# Altium schematic sheet ATSAM3X8E Main Controller - TR R1.1.SchDoc
size Tabloid; DocumentNumber: 1; SheetNumber: 1; SheetTotal: 8
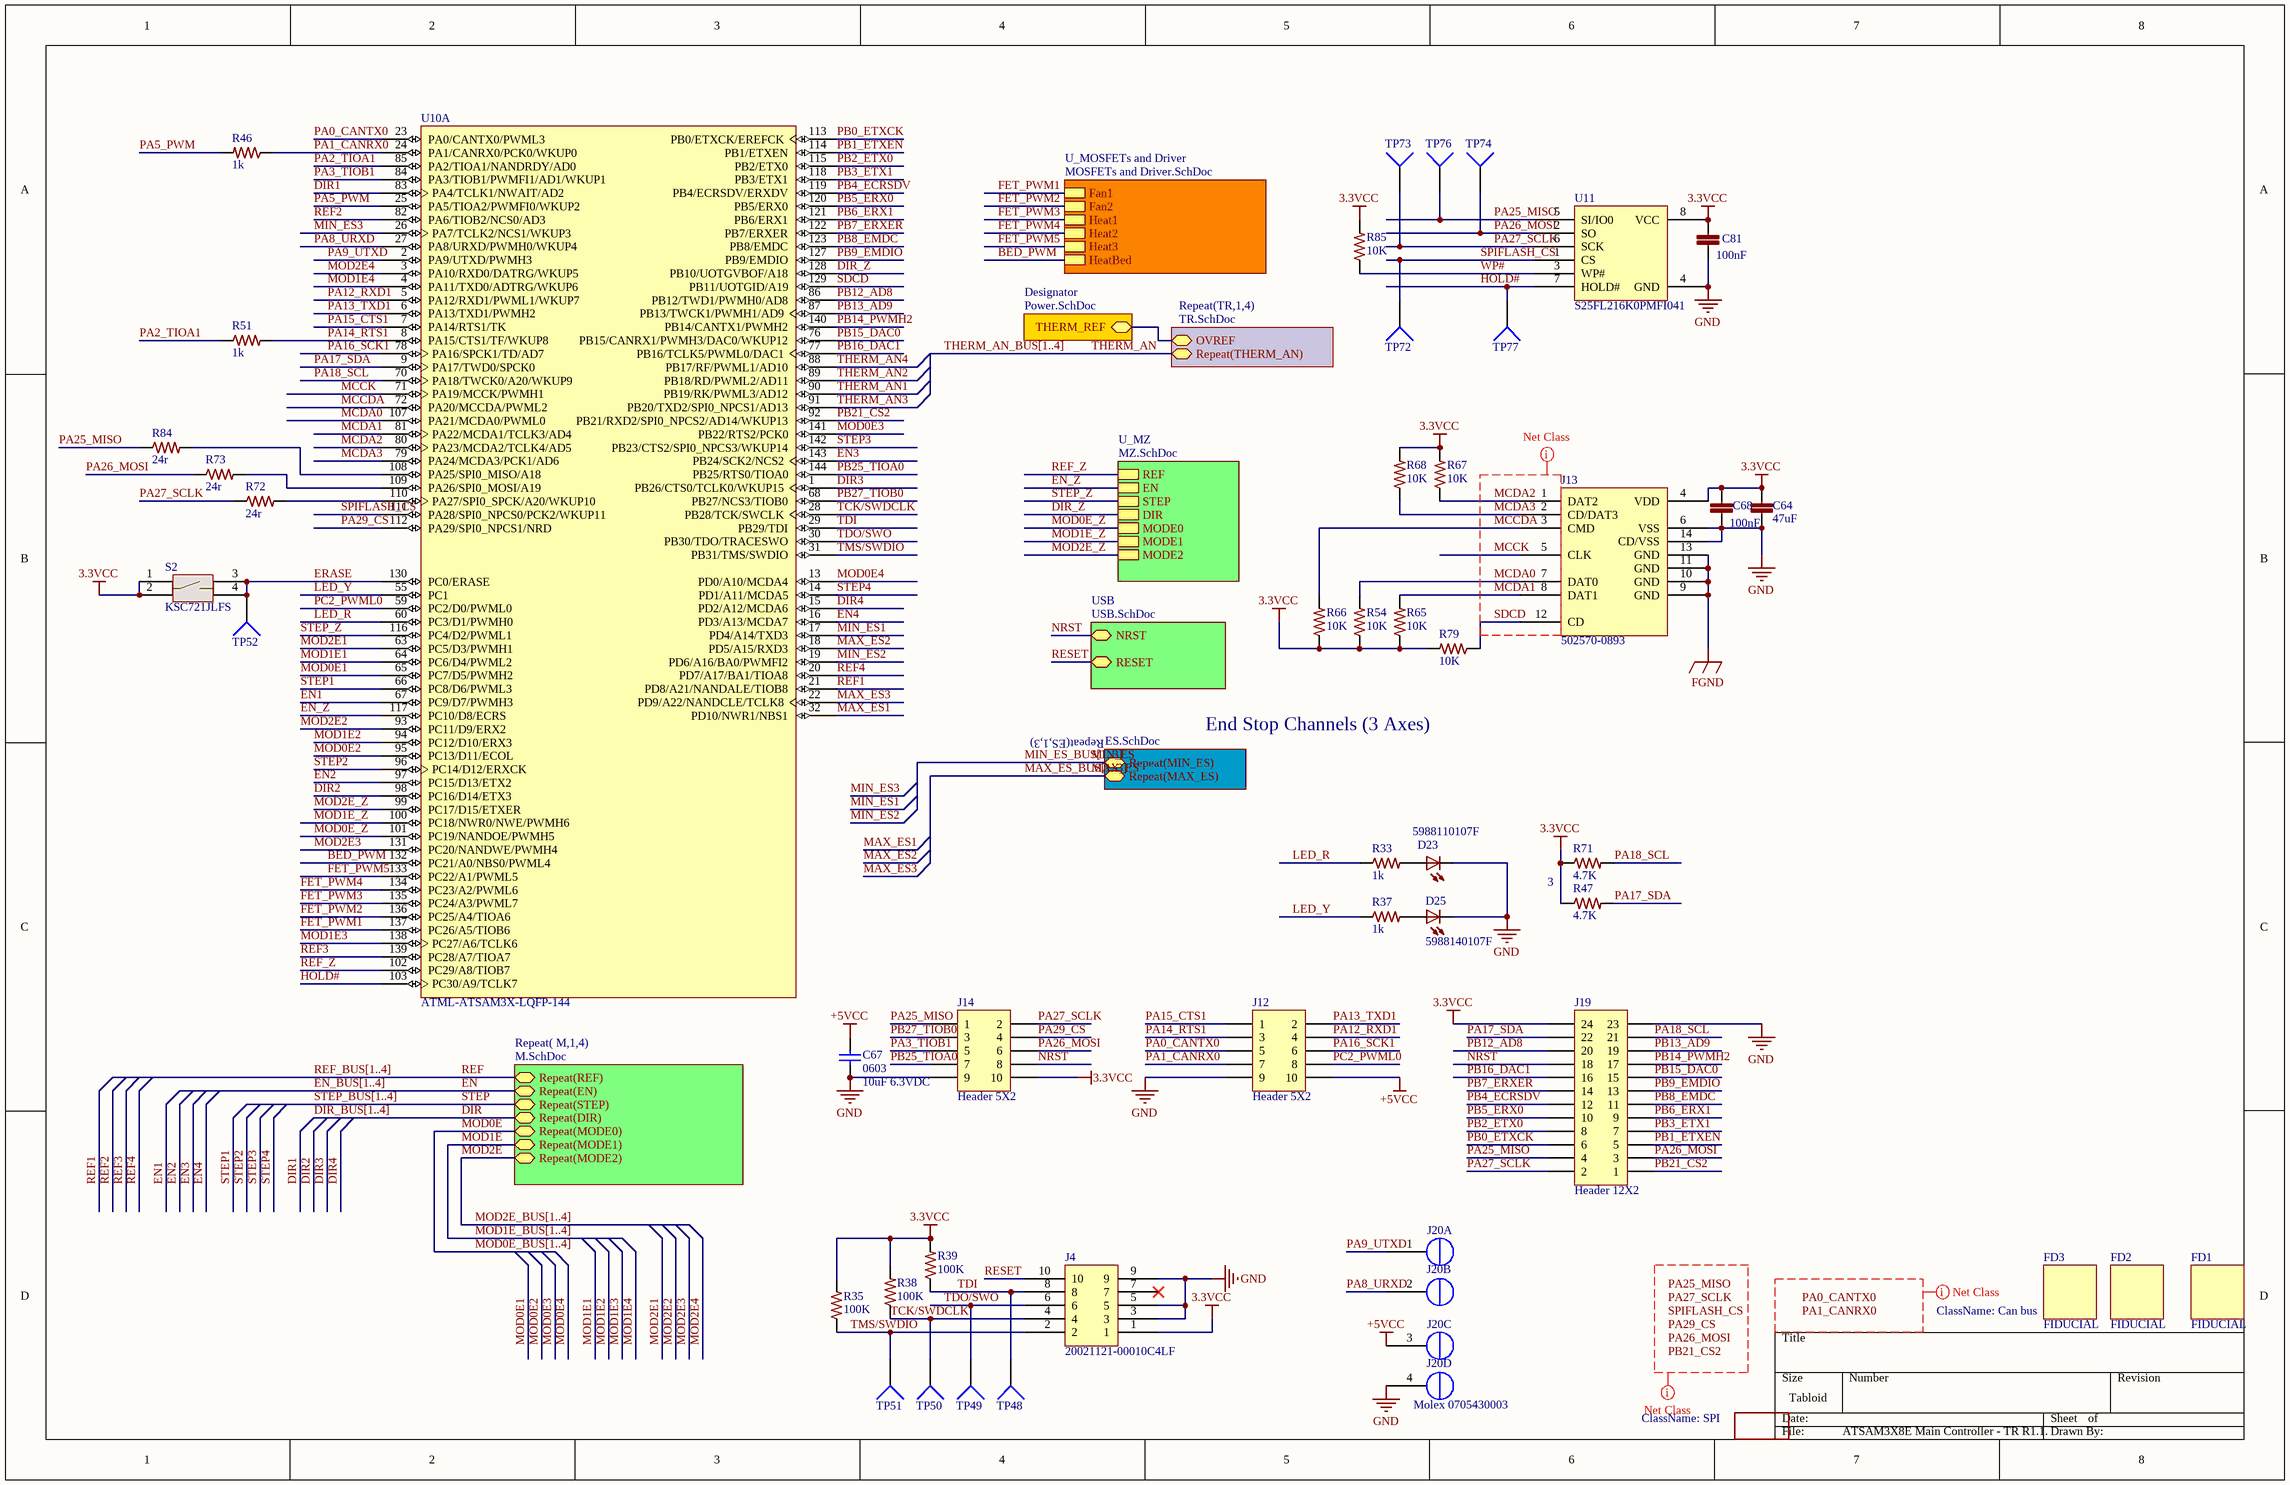
[diagram p0: ATSAM3X8E Main Controller - TR R1.1.SchDoc]

## Parts
C64  47uF  [C0805]
C67  0603  value 10uF 6.3VDC  [C0603]
C68  100nF  [C0402]
C81  100nF  [C0402]
D23  5988110107F  [LED2012120]
D25  5988140107F  [LED2012120]
FD1  FIDUCIAL  [FIDUCIAL-1X2]
FD2  FIDUCIAL  [FIDUCIAL-1X2]
FD3  FIDUCIAL  [FIDUCIAL-1X2]
J4  20021121-00010C4LF  [FTSH-105-XX-X-DV]
J12  Header 5X2  [HDR2X5]
J13  502570-0893  [502570-0893 - Molex SD]
J14  Header 5X2  [HDR2X5]
J19  Header 12X2  [HDR2X12]
J20  Molex 0705430003  [4POL254]  (parts A,B,C,D of 4)
LOGO1  OSHW_LOGO_8MILX0150-NT  [OSHW_8X150_NOTEXT]  (value not drawn)
R33  1k  [R0402]
R35  100K  [R0402]
R37  1k  [R0402]
R38  100K  [R0402]
R39  100K  [R0402]
R46  1k  [R0402]
R47  4.7K  [R0603]
R51  1k  [R0402]
R54  10K  [R0402]
R65  10K  [R0402]
R66  10K  [R0402]
R67  10K  [R0402]
R68  10K  [R0402]
R71  4.7K  [R0603]
R72  24r  [R0402]
R73  24r  [R0402]
R79  10K  [R0402]
R84  24r  [R0402]
R85  10K  [R0402]
S2  KSC721JLFS  [KSC721JLFS]
TP48  TP4  [TP-2]  (value not drawn)
TP49  TP4  [TP-2]  (value not drawn)
TP50  TP4  [TP-2]  (value not drawn)
TP51  TP4  [TP-2]  (value not drawn)
TP52  TP4  [TP-2]  (value not drawn)
TP72  TP4  [TP-2]  (value not drawn)
TP73  TP4  [TP-2]  (value not drawn)
TP74  TP4  [TP-2]  (value not drawn)
TP76  TP4  [TP-2]  (value not drawn)
TP77  TP4  [TP-2]  (value not drawn)
U10  ATML-ATSAM3X-LQFP-144  [LQFP144_N]  (part A of 3)
U11  S25FL216K0PMFI041  [S25FL216K0PMFI041]

## Sub-sheets
Designator = Power.SchDoc: THERM_REF
Repeat( M,1,4) = M.SchDoc: Repeat(REF), Repeat(EN), Repeat(STEP), Repeat(DIR), Repeat(MODE0), Repeat(MODE1), Repeat(MODE2)
Repeat(ES,1,3) = ES.SchDoc: Repeat(MAX_ES), Repeat(MIN_ES)
Repeat(TR,1,4) = TR.SchDoc: OVREF, Repeat(THERM_AN)
U_MOSFETs and Driver = MOSFETs and Driver.SchDoc: Fan1, Fan2, Heat1, Heat2, Heat3, HeatBed
U_MZ = MZ.SchDoc: REF, EN, STEP, DIR, MODE0, MODE1, MODE2
USB = USB.SchDoc: NRST, RESET

## Nets
3.3VCC: C64.1 C68.1 C81.1 J4.1 J13.4(VDD) J14.10 J19.24 R35.2 R38.2 R39.2 R47.1 R54.1 R65.1 R66.1 R67.2 R68.2 R71.1 R79.2 R85.2 S2.1 S2.2 U11.8(VCC)
+5VCC: C67.2 J12.10 J20.3(OUT1A)
FGND: J13.9(GND) J13.10(GND) J13.11(GND) J13.13(GND)
GND: C64.2 C67.1 C68.2 C81.2 D23.C D25.C J4.3 J4.5 J4.9 J12.9 J13.6(VSS) J13.14(CD/VSS) J14.9 J19.23 J20.4(OUT1B) U11.4(GND)
BED_PWM: U10.132(PC21/A0/NBS0/PWML4) ; sheet U_MOSFETs and Driver/HeatBed
DIR: sheet Repeat( M,1,4)/Repeat(DIR)
DIR1: U10.83(PA4/TCLK1/NWAIT/AD2)
DIR2: U10.98(PC16/D14/ETX3)
DIR3: U10.1(PB26/CTS0/TCLK0/WKUP15)
DIR4: U10.15(PD2/A12/MCDA6)
DIR_Z: U10.128(PB10/UOTGVBOF/A18) ; sheet U_MZ/DIR
EN: sheet Repeat( M,1,4)/Repeat(EN)
EN1: U10.67(PC9/D7/PWMH3)
EN2: U10.97(PC15/D13/ETX2)
EN3: U10.143(PB24/SCK2/NCS2)
EN4: U10.16(PD3/A13/MCDA7)
EN_Z: U10.117(PC10/D8/ECRS) ; sheet U_MZ/EN
ERASE: S2.3 S2.4 TP52.1 U10.130(PC0/ERASE)
FET_PWM1: U10.137(PC26/A5/TIOB6) ; sheet U_MOSFETs and Driver/Fan1
FET_PWM2: U10.136(PC25/A4/TIOA6) ; sheet U_MOSFETs and Driver/Fan2
FET_PWM3: U10.135(PC24/A3/PWML7) ; sheet U_MOSFETs and Driver/Heat1
FET_PWM4: U10.134(PC23/A2/PWML6) ; sheet U_MOSFETs and Driver/Heat2
FET_PWM5: U10.133(PC22/A1/PWML5) ; sheet U_MOSFETs and Driver/Heat3
HOLD#: TP77.1 U10.103(PC30/A9/TCLK7) U11.7(HOLD#)
LED_R: R33.1 U10.60(PC3/D1/PWMH0)
LED_Y: R37.1 U10.55(PC1)
MAX_ES: sheet Repeat(ES,1,3)/Repeat(MAX_ES)
MAX_ES1: U10.32(PD10/NWR1/NBS1)
MAX_ES2: U10.18(PD5/A15/RXD3)
MAX_ES3: U10.22(PD9/A22/NANDCLE/TCLK8)
MCCDA: J13.3(CMD) R66.2 U10.72(PA20/MCCDA/PWML2)
MCCK: J13.5(CLK) U10.71(PA19/MCCK/PWMH1)
MCDA0: J13.7(DAT0) R54.2 U10.107(PA21/MCDA0/PWML0)
MCDA1: J13.8(DAT1) R65.2 U10.81(PA22/MCDA1/TCLK3/AD4)
MCDA2: J13.1(DAT2) R67.1 U10.80(PA23/MCDA2/TCLK4/AD5)
MCDA3: J13.2(CD/DAT3) R68.1 U10.79(PA24/MCDA3/PCK1/AD6)
MIN_ES: sheet Repeat(ES,1,3)/Repeat(MIN_ES)
MIN_ES1: U10.17(PD4/A14/TXD3)
MIN_ES2: U10.19(PD6/A16/BA0/PWMFI2)
MIN_ES3: U10.26(PA7/TCLK2/NCS1/WKUP3)
MOD0E: sheet Repeat( M,1,4)/Repeat(MODE0)
MOD0E1: U10.65(PC7/D5/PWMH2)
MOD0E2: U10.95(PC13/D11/ECOL)
MOD0E3: U10.141(PB22/RTS2/PCK0)
MOD0E4: U10.13(PD0/A10/MCDA4)
MOD0E_Z: U10.101(PC19/NANDOE/PWMH5) ; sheet U_MZ/MODE0
MOD1E: sheet Repeat( M,1,4)/Repeat(MODE1)
MOD1E1: U10.64(PC6/D4/PWML2)
MOD1E2: U10.94(PC12/D10/ERX3)
MOD1E3: U10.138(PC27/A6/TCLK6)
MOD1E4: U10.4(PA11/TXD0/ADTRG/WKUP6)
MOD1E_Z: U10.100(PC18/NWR0/NWE/PWMH6) ; sheet U_MZ/MODE1
MOD2E: sheet Repeat( M,1,4)/Repeat(MODE2)
MOD2E1: U10.63(PC5/D3/PWMH1)
MOD2E2: U10.93(PC11/D9/ERX2)
MOD2E3: U10.131(PC20/NANDWE/PWMH4)
MOD2E4: U10.3(PA10/RXD0/DATRG/WKUP5)
MOD2E_Z: U10.99(PC17/D15/ETXER) ; sheet U_MZ/MODE2
NRST: J14.8 J19.18 ; sheet USB/NRST
PA0_CANTX0: J12.5 U10.23(PA0/CANTX0/PWML3)
PA1_CANRX0: J12.7 R46.1 U10.24(PA1/CANRX0/PCK0/WKUP0)
PA2_TIOA1: R51.1 U10.85(PA2/TIOA1/NANDRDY/AD0)
PA3_TIOB1: J14.5 U10.84(PA3/TIOB1/PWMFI1/AD1/WKUP1)
PA5_PWM: R46.2 U10.25(PA5/TIOA2/PWMFI0/WKUP2)
PA8_URXD: J20.2(OUT2A) U10.27(PA8/URXD/PWMH0/WKUP4)
PA9_UTXD: J20.1(OUT2B) U10.2(PA9/UTXD/PWMH3)
PA12_RXD1: J12.4 U10.5(PA12/RXD1/PWML1/WKUP7)
PA13_TXD1: J12.2 U10.6(PA13/TXD1/PWMH2)
PA14_RTS1: J12.3 R51.2 U10.8(PA15/CTS1/TF/WKUP8)
PA15_CTS1: J12.1 U10.7(PA14/RTS1/TK)
PA16_SCK1: J12.6 U10.78(PA16/SPCK1/TD/AD7)
PA17_SDA: J19.22 R47.2 U10.9(PA17/TWD0/SPCK0)
PA18_SCL: J19.21 R71.2 U10.70(PA18/TWCK0/A20/WKUP9)
PA25_MISO: J14.1 J19.4 R84.1 TP76.1 U11.5(SI/IO0)
PA26_MOSI: J14.6 J19.3 R73.1 TP74.1 U11.2(SO)
PA27_SCLK: J14.2 J19.2 R72.1 TP73.1 U11.6(SCK)
PA29_CS: J14.4 U10.112(PA29/SPI0_NPCS1/NRD)
PB0_ETXCK: J19.6 U10.113(PB0/ETXCK/EREFCK)
PB1_ETXEN: J19.5 U10.114(PB1/ETXEN)
PB2_ETX0: J19.8 U10.115(PB2/ETX0)
PB3_ETX1: J19.7 U10.118(PB3/ETX1)
PB4_ECRSDV: J19.12 U10.119(PB4/ECRSDV/ERXDV)
PB5_ERX0: J19.10 U10.120(PB5/ERX0)
PB6_ERX1: J19.9 U10.121(PB6/ERX1)
PB7_ERXER: J19.14 U10.122(PB7/ERXER)
PB8_EMDC: J19.11 U10.123(PB8/EMDC)
PB9_EMDIO: J19.13 U10.127(PB9/EMDIO)
PB12_AD8: J19.20 U10.86(PB12/TWD1/PWMH0/AD8)
PB13_AD9: J19.19 U10.87(PB13/TWCK1/PWMH1/AD9)
PB14_PWMH2: J19.17 U10.140(PB14/CANTX1/PWMH2)
PB15_DAC0: J19.15 U10.76(PB15/CANRX1/PWMH3/DAC0/WKUP12)
PB16_DAC1: J19.16 U10.77(PB16/TCLK5/PWML0/DAC1)
PB21_CS2: J19.1 U10.92(PB21/RXD2/SPI0_NPCS2/AD14/WKUP13)
PB25_TIOA0: J14.7 U10.144(PB25/RTS0/TIOA0)
PB27_TIOB0: J14.3 U10.68(PB27/NCS3/TIOB0)
PC2_PWML0: J12.8 U10.59(PC2/D0/PWML0)
REF: sheet Repeat( M,1,4)/Repeat(REF)
REF1: U10.21(PD8/A21/NANDALE/TIOB8)
REF2: U10.82(PA6/TIOB2/NCS0/AD3)
REF3: U10.139(PC28/A7/TIOA7)
REF4: U10.20(PD7/A17/BA1/TIOA8)
REF_Z: U10.102(PC29/A8/TIOB7) ; sheet U_MZ/REF
RESET: J4.10 ; sheet USB/RESET
SDCD: J13.12(CD) R79.1 U10.129(PB11/UOTGID/A19)
SPIFLASH_CS: TP72.1 U10.111(PA28/SPI0_NPCS0/PCK2/WKUP11) U11.1(CS)
STEP: sheet Repeat( M,1,4)/Repeat(STEP)
STEP1: U10.66(PC8/D6/PWML3)
STEP2: U10.96(PC14/D12/ERXCK)
STEP3: U10.142(PB23/CTS2/SPI0_NPCS3/WKUP14)
STEP4: U10.14(PD1/A11/MCDA5)
STEP_Z: U10.116(PC4/D2/PWML1) ; sheet U_MZ/STEP
TCK/SWDCLK: J4.4 R38.1 TP50.1 U10.28(PB28/TCK/SWCLK)
TDI: J4.8 R39.1 TP48.1 U10.29(PB29/TDI)
TDO/SWO: J4.6 TP49.1 U10.30(PB30/TDO/TRACESWO)
THERM_AN: sheet Repeat(TR,1,4)/Repeat(THERM_AN)
THERM_AN1: U10.90(PB19/RK/PWML3/AD12)
THERM_AN2: U10.89(PB18/RD/PWML2/AD11)
THERM_AN3: U10.91(PB20/TXD2/SPI0_NPCS1/AD13)
THERM_AN4: U10.88(PB17/RF/PWML1/AD10)
TMS/SWDIO: J4.2 R35.1 TP51.1 U10.31(PB31/TMS/SWDIO)
WP#: R85.1 U11.3(WP#)
NetD23_A: D23.A R33.2
NetD25_A: D25.A R37.2
NetR72_2: R72.2 U10.110(PA27/SPI0_SPCK/A20/WKUP10)
NetR73_2: R73.2 U10.109(PA26/SPI0_MOSI/A19)
NetR84_2: R84.2 U10.108(PA25/SPI0_MISO/A18)
(unnamed): sheet Repeat(TR,1,4)/OVREF, sheet Designator/THERM_REF

Not connected (* = marked no-connect by the designer): J4 7*

## Buses and harness runs
bus DIR_BUS[1..4]
bus EN_BUS[1..4]
bus MAX_ES_BUS[1..3]
bus MIN_ES_BUS[1..3]
bus MOD0E_BUS[1..4]
bus MOD1E_BUS[1..4]
bus MOD2E_BUS[1..4]
bus REF_BUS[1..4]
bus STEP_BUS[1..4]
bus THERM_AN_BUS[1..4]

## Layout directives
net class SD: MCCDA, MCCK, MCDA0, MCDA1, MCDA2, MCDA3, SDCD
net class Can bus: PA0_CANTX0, PA1_CANRX0
net class SPI: PA25_MISO, PA26_MOSI, PA27_SCLK, PA29_CS, PB21_CS2, SPIFLASH_CS

## Notes on the sheet
- End Stop Channels (3 Axes)
- 3
- Labels drawn without touching a wire or pin: PA0_CANTX0, PA1_CANRX0, PA25_MISO, PA26_MOSI, PA27_SCLK, PA29_CS, PB21_CS2, SPIFLASH_CS

## Library data of the parts
C64 = CL21A476MQCLRNC: CAP CER 47UF 6.3V 20% X5R 0805; Manufacturer: Samsung; LastRevisionNote: ImportComponents; Published: 10 - may 2015; Publisher: UltiMachine; LastRevisionDate: 10 may 2015; ManufacturerPartNumber: CL21A476MQCLRNC; VALUE: 47uF
C67 = C1608JB0J106K080AB: CAP CER 10UF 6.3V 10% JB 0603; MFR: TDK; Voltage: 6.3VDC; Published: 10 - Dec - 2014; LatestRevisionDate: 10 - Dec - 2014; Component Type: Chip Capacitor; MFR Part #: C1608JB0J106K080AB; Part Description: CAP CER 10UF 6.3V 10% JB 0603; Mounting Type: SMT 0603; Datasheet: http://www.tdk.com/pdf/TDKMLCCCapRange.pdf; Height: 0.9mm; Tolerance: 10%; Digikey #: 445-11185-1-ND; PackageReference: 0402
C68 C81 = GRM155R71C104KA88D: CAP CER 0402 100nF 16V 10% X7R; LastRevisionNote: ImportComponents; Published: 23-Apr-2014; Publisher: UltiMachine; LastRevisionDate: 23-Apr-2014; ManufacturerPartNumber: GRM155R71C104KA88D; VALUE: 100nF
D23 = 5988110107F: LED 0805 Red; LastRevisionNote: ImportComponents; Published: 23-Apr-2014; Publisher: UltiMachine; LastRevisionDate: 23-Apr-2014; VALUE: 5988110107F
D25 = 5988140107F: LED 0805 Yellow; LastRevisionNote: ImportComponents; Published: 23-Apr-2014; Publisher: UltiMachine; LastRevisionDate: 23-Apr-2014; VALUE: 5988140107F
J4 = ARM Cortex JTAG-DEBUG Header
J12 J14 = Header 5X2: Header, 5-Pin, Dual row; LatestRevisionDate: 17-Jul-2002; LatestRevisionNote: Re-released for DXP Platform.; Publisher: Altium Limited
J13 = 502570-0893: microSD 502570-0893 Molex Part
J19 = Header 12X2: Header, 12-Pin, Dual row; LatestRevisionDate: 17-Jul-2002; LatestRevisionNote: Re-released for DXP Platform.; Publisher: Altium Limited
J20 = Molex 0705430003 Alt: Molex 4 Pin Clip Connector
LOGO1 = OSHW_LOGO_8MILX0150-NT: LastRevisionNote: ImportComponents; Published: 23-Apr-2014; Publisher: UltiMachine; LastRevisionDate: 23-Apr-2014
R33 R37 R46 R51 = RK73H1ETTP1001F: RES 0402 1k 63mW 1%; LastRevisionNote: ImportComponents; Published: 23-Apr-2014; Publisher: UltiMachine; LastRevisionDate: 23-Apr-2014; VALUE: 1k
R35 R38 R39 = RC1005F104CS: RES SMD 100K OHM 1% 1/16W 0402; Manufacturer: Samsung; LastRevisionNote: ImportComponents; Digilkey #: 1276-3432-1-ND; Published: 23-Apr-2014; Publisher: UltiMachine; LastRevisionDate: 23-Apr-2014; ManufacturerPartNumber: RC1005F104CS; VALUE: 100K
R47 R71 = ERJ3EKF4701V: RES 0603 4.7K 100mW 1%; LastRevisionNote: ImportComponents; Published: 23-Apr-2014; Publisher: UltiMachine; LastRevisionDate: 23-Apr-2014; ManufacturerPartNumber: ERJ3EKF4701V; VALUE: 4.7K
R54 R65-R68 R79 R85 = RC0402FR-0710KP: RES SMD 10K OHM 1% 1/16W 0402; LastRevisionNote: ImportComponents; Published: 23-Apr-2014; Publisher: UltiMachine; LastRevisionDate: 23-Apr-2014; ManufacturerPartNumber: RC0402FR-0710KP; VALUE: 10K
R72 R73 R84 = CRCW040224R0FKED: Res Thick Film 0402 24 Ohm 1% 0.063W; ManufacturerPartNumber: CRCW0402200KFKED; LastRevisionNote: ImportComponents; Published: 23-Apr-2014; Publisher: UltiMachine; LastRevisionDate: 23-Apr-2014; VALUE: 24r
S2 = KSC721JLFS: Switch SPST 1.7 N / 1.8 N J Bend Surface Mount Tactile Switch
TP48-TP52 TP72-TP74 TP76 TP77 = Socket: LatestRevisionDate: 17-Jul-2002; LatestRevisionNote: Re-released for DXP Platform.; Publisher: Altium Limited
U11 = S25FL216K0PMFI041: Manufacture: Spansion; Active: Yes; Manufacture Part #: S25FL216K0PMFI041; Mounting Type: SMD; Type: SOIC; Datasheet: http://www.spansion.com/Support/Datasheets/S25FL216K_00.pdf; Digikey Part NUmber: 1274-1052-ND; Price: $0.35